# EAGLE board rep_ctrlr (EAGLE 6.2), part 1 of 2
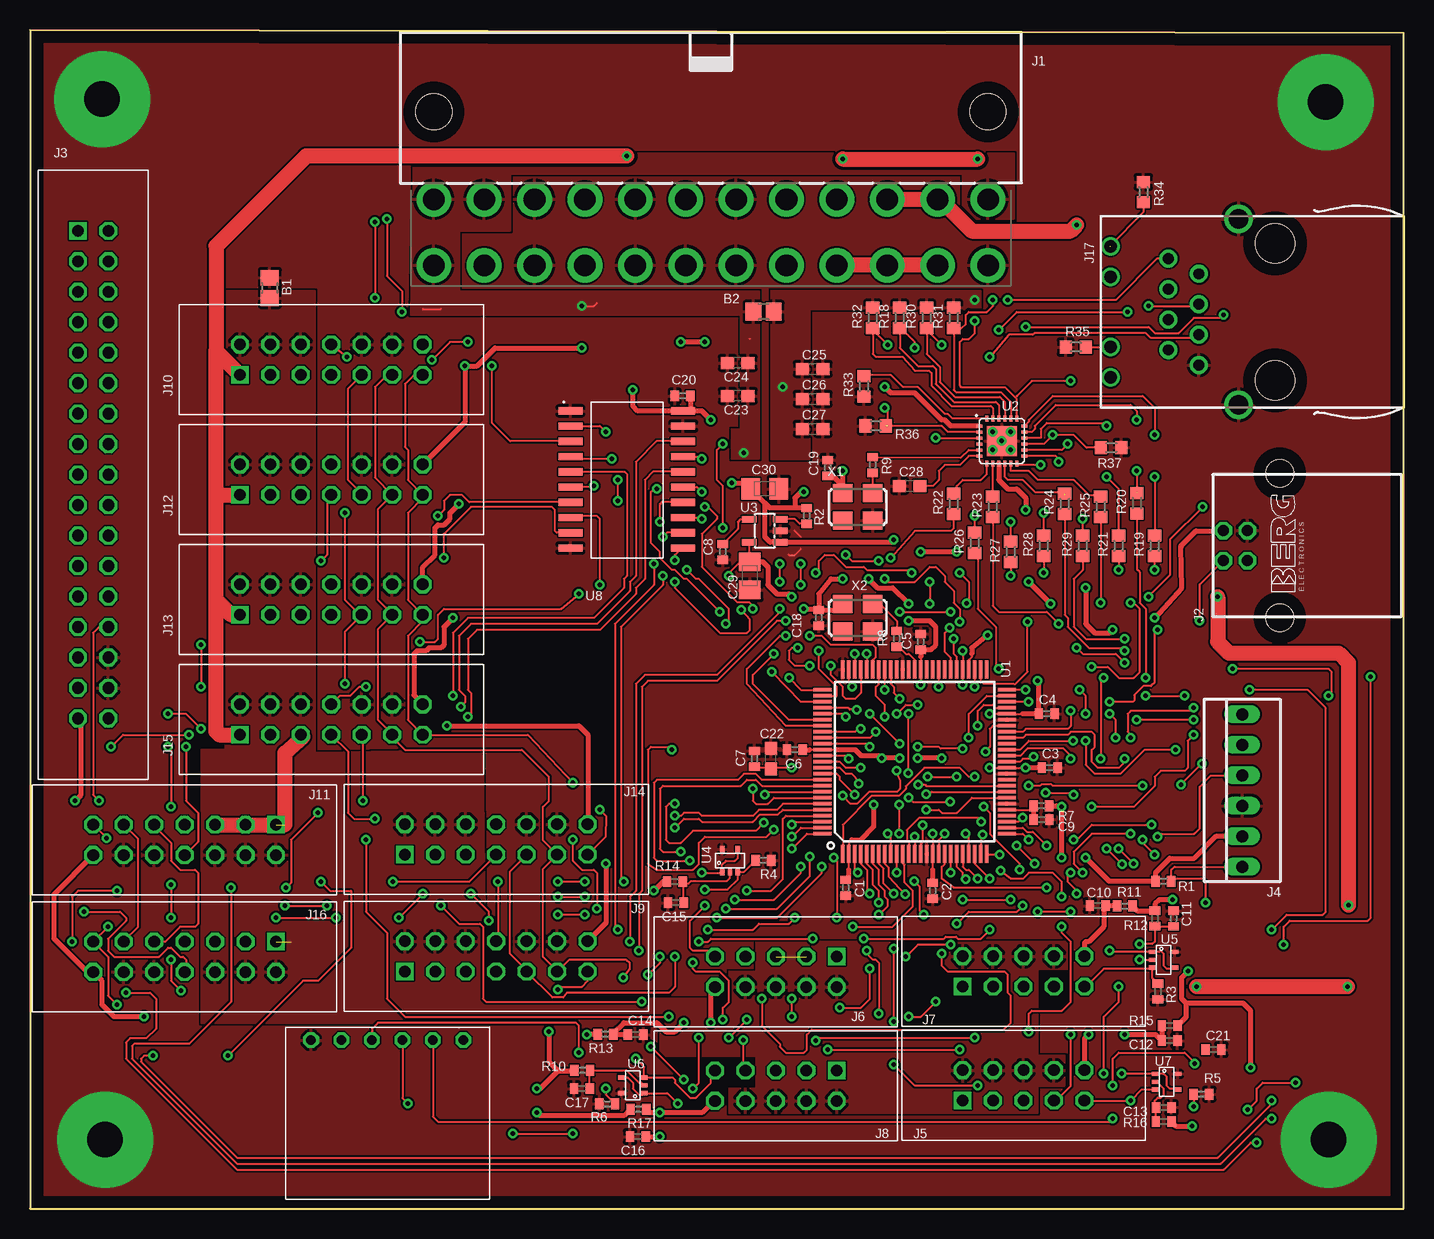
[diagram p5: board, top side]
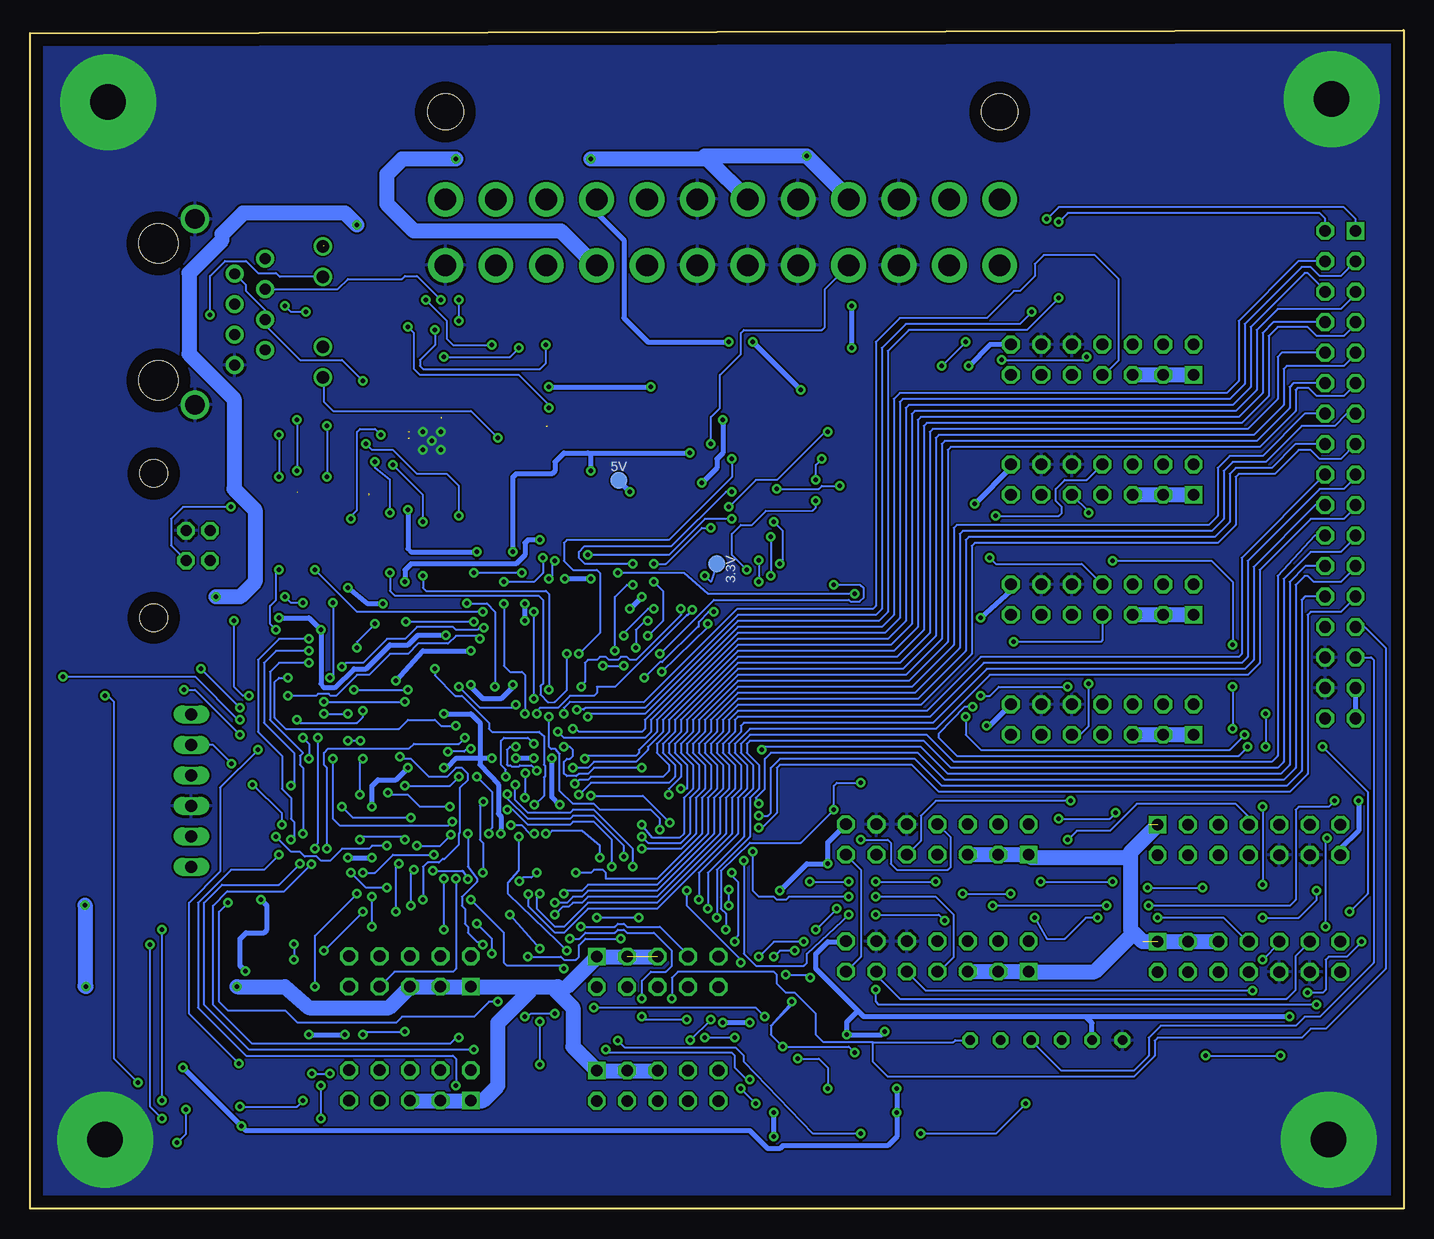
[diagram p6: board, bottom side, seen from below]

Size 114.5 x 98.25 mm. Coordinates in mm from the lower left corner, seen from the top.
Outline: 0,0 114.5,0 114.5,98 0,98.25 0,0
Copper layers (1*16): Top 0.035mm / dielectric 1.5mm / Bottom 0.035mm
Design rules: minimum track width 6mil, minimum drill 15mil, track to track 6mil, track to pad 6mil, pad to pad 6mil, via to via 6mil, smd to smd 6mil, copper to edge 40mil, drill to drill 4mil, minimum pad ring 10mil, minimum via ring 8mil, stop-mask expansion 4mil, vias tented up to drill 0mil, thermal gap 10mil

## Footprints (pad centres in the part's own frame; a part is rotated, then mirrored left to right if it is on the bottom)
TP14R = smd 1.4 x 1.4: TP 0,0
R0805 = smd 1.3 x 1.5: 1 -0.85,0; 2 0.85,0
C0402 = smd 0.7 x 0.9: 1 -0.65,0; 2 0.65,0
C0603 = smd 1.1 x 1: 1 -0.85,0; 2 0.85,0
R/2012-12R = smd 1.55 x 1.8: + 1.175,0; - -1.175,0
ATX24_RIGHT_ANGLE = drill 1.8 pad 2.9: 1 23.1,4.76; 2 18.9,4.76; 3 14.7,4.76; 4 10.5,4.76; 5 6.3,4.76; 6 2.1,4.76; 7 -2.1,4.76; 8 -6.3,4.76; 9 -10.5,4.76; 10 -14.7,4.76; 11 -18.9,4.76; 12 -23.1,4.76; 13 23.1,10.26; 14 18.9,10.26; 15 14.7,10.26; 16 10.5,10.26; 17 6.3,10.26; 18 2.1,10.26; 19 -2.1,10.26; 20 -6.3,10.26; 21 -10.5,10.26; 22 -14.7,10.26; 23 -18.9,10.26; 24 -23.1,10.26 | hole 3: -23.1,-2.54; 23.1,-2.54
PN61729 = drill 0.95 octagon: 1 1.25,4.71; 2 -1.25,4.71; 3 -1.25,2.71; 4 1.25,2.71 | hole 2.3: -6.02,0; 6.02,0
SBH11-PBPC-D17-ST-BK = drill 0.991 square: 1 0,0 | drill 0.991 octagon: 2 2.54,0; 3 0,-2.54; 4 2.54,-2.54; 5 0,-5.08; 6 2.54,-5.08; 7 0,-7.62; 8 2.54,-7.62; 9 0,-10.16; 10 2.54,-10.16; 11 0,-12.7; 12 2.54,-12.7; 13 0,-15.24; 14 2.54,-15.24; 15 0,-17.78; 16 2.54,-17.78; 17 0,-20.32; 18 2.54,-20.32; 19 0,-22.86; 20 2.54,-22.86; 21 0,-25.4; 22 2.54,-25.4; 23 0,-27.94; 24 2.54,-27.94; 25 0,-30.48; 26 2.54,-30.48; 27 0,-33.02; 28 2.54,-33.02; 29 0,-35.56; 30 2.54,-35.56; 31 0,-38.1; 32 2.54,-38.1; 33 0,-40.64; 34 2.54,-40.64
22-23-2061 = drill 1 long: 1 -6.35,0; 2 -3.81,0; 3 -1.27,0; 4 1.27,0; 5 3.81,0; 6 6.35,0
SBH11-PBPC-D05-ST-BK = drill 0.991 square: 1 0,0 | drill 0.991 octagon: 2 2.54,0; 3 0,-2.54; 4 2.54,-2.54; 5 0,-5.08; 6 2.54,-5.08; 7 0,-7.62; 8 2.54,-7.62; 9 0,-10.16; 10 2.54,-10.16
SBH11-PBPC-D07-ST-BK = drill 0.991 square: 1 0,0 | drill 0.991 octagon: 2 2.54,0; 3 0,-2.54; 4 2.54,-2.54; 5 0,-5.08; 6 2.54,-5.08; 7 0,-7.62; 8 2.54,-7.62; 9 0,-10.16; 10 2.54,-10.16; 11 0,-12.7; 12 2.54,-12.7; 13 0,-15.24; 14 2.54,-15.24
SI-50170 = drill 0.9 pad 1.5: 1 4.445,5.842; 2 3.175,3.302; 3 1.905,5.842; 4 0.635,3.302; 5 -0.635,5.842; 6 -1.905,3.302; 7 -3.175,5.842; 8 -4.445,3.302 | drill 1.016 pad 1.5: A1 -5.461,10.668; A2 2.921,10.668; C1 -2.921,10.668; C2 5.461,10.668 | drill 1.6 pad 2.2: S1 -7.747,0; S2 7.747,0 | hole 3.251: -5.715,-3.048; 5.715,-3.048
70553-0109 = drill 0.8 pad 1.09 octagon: P$1 5.08,-7.62; P$2 5.08,-5.08; P$3 5.08,-2.54; P$4 5.08,0; P$5 5.08,2.54; P$6 5.08,5.08
R0402 = smd 0.7 x 0.9: 1 -0.65,0; 2 0.65,0
R0603 = smd 1 x 1.1: 1 -0.85,0; 2 0.85,0
MICROCHIP_TQ100-PF = smd 1.5 x 0.3: 1 -7.7,6; 2 -7.7,5.5; 3 -7.7,5; 4 -7.7,4.5; 5 -7.7,4; 6 -7.7,3.5; 7 -7.7,3; 8 -7.7,2.5; 9 -7.7,2; 10 -7.7,1.5; 11 -7.7,1; 12 -7.7,0.5; 13 -7.7,0; 14 -7.7,-0.5; 15 -7.7,-1; 16 -7.7,-1.5; 17 -7.7,-2; 18 -7.7,-2.5; 19 -7.7,-3; 20 -7.7,-3.5; 21 -7.7,-4; 22 -7.7,-4.5; 23 -7.7,-5; 24 -7.7,-5.5; 25 -7.7,-6; 51 7.7,-6; 52 7.7,-5.5; 53 7.7,-5; 54 7.7,-4.5; 55 7.7,-4; 56 7.7,-3.5; 57 7.7,-3; 58 7.7,-2.5; 59 7.7,-2; 60 7.7,-1.5; 61 7.7,-1; 62 7.7,-0.5; 63 7.7,0; 64 7.7,0.5; 65 7.7,1; 66 7.7,1.5; 67 7.7,2; 68 7.7,2.5; 69 7.7,3; 70 7.7,3.5; 71 7.7,4; 72 7.7,4.5; 73 7.7,5; 74 7.7,5.5; 75 7.7,6 | smd 0.3 x 1.5: 26 -6,-7.7; 27 -5.5,-7.7; 28 -5,-7.7; 29 -4.5,-7.7; 30 -4,-7.7; 31 -3.5,-7.7; 32 -3,-7.7; 33 -2.5,-7.7; 34 -2,-7.7; 35 -1.5,-7.7; 36 -1,-7.7; 37 -0.5,-7.7; 38 0,-7.7; 39 0.5,-7.7; 40 1,-7.7; 41 1.5,-7.7; 42 2,-7.7; 43 2.5,-7.7; 44 3,-7.7; 45 3.5,-7.7; 46 4,-7.7; 47 4.5,-7.7; 48 5,-7.7; 49 5.5,-7.7; 50 6,-7.7; 76 6,7.7; 77 5.5,7.7; 78 5,7.7; 79 4.5,7.7; 80 4,7.7; 81 3.5,7.7; 82 3,7.7; 83 2.5,7.7; 84 2,7.7; 85 1.5,7.7; 86 1,7.7; 87 0.5,7.7; 88 0,7.7; 89 -0.5,7.7; 90 -1,7.7; 91 -1.5,7.7; 92 -2,7.7; 93 -2.5,7.7; 94 -3,7.7; 95 -3.5,7.7; 96 -4,7.7; 97 -4.5,7.7; 98 -5,7.7; 99 -5.5,7.7; 100 -6,7.7
QFN24 = smd 0.5 x 0.25: P1 -1.875,1.25; P2 -1.875,0.75; P3 -1.875,0.25; P4 -1.875,-0.25; P5 -1.875,-0.75; P6 -1.875,-1.25; P13 1.875,-1.25; P14 1.875,-0.75; P15 1.875,-0.25; P16 1.875,0.25; P17 1.875,0.75; P18 1.875,1.25 | smd 0.25 x 0.5: P7 -1.25,-1.875; P8 -0.75,-1.875; P9 -0.25,-1.875; P10 0.25,-1.875; P11 0.75,-1.875; P12 1.25,-1.875; P19 1.25,1.875; P20 0.75,1.875; P21 0.25,1.875; P22 -0.25,1.875; P23 -0.75,1.875; P24 -1.25,1.875 | smd 2.5 x 2.5: PAD 0,0
SOT23-5 = smd 0.55 x 1.2: 1 -0.95,-1.3; 2 0,-1.3; 3 0.95,-1.3; 4 0.95,1.3; 5 -0.95,1.3
MICROCHIP_SC70-5-LT = smd 0.35 x 0.55: 1 -0.65,-0.95; 2 0,-0.95; 3 0.65,-0.95; 4 0.65,0.95; 5 -0.65,0.95
20-SOIC = smd 2 x 0.6: 1 -4.7,5.75; 2 -4.7,4.48; 3 -4.7,3.21; 4 -4.7,1.94; 5 -4.7,0.67; 6 -4.7,-0.6; 7 -4.7,-1.87; 8 -4.7,-3.14; 9 -4.7,-4.41; 10 -4.7,-5.68; 11 4.7,-5.68; 12 4.7,-4.41; 13 4.7,-3.14; 14 4.7,-1.87; 15 4.7,-0.6; 16 4.7,0.67; 17 4.7,1.94; 18 4.7,3.21; 19 4.7,4.48; 20 4.7,5.75
ASF = smd 1.6 x 1.5: 1 -1.25,-1.15; 2 1.25,-1.15; 3 1.25,1.15; 4 -1.25,1.15

## Placement (x,y rotation side)
3.3V  PTR1TP14R  [TP14R]  57.25,53.75 270 bottom
5V  PTR1TP14R  [TP14R]  65.4,60.7 0 bottom
B1  FERRITE  [R0805]  19.98,76.75 270 top
B2  FERRITE  [R0805]  61.16,74.77 180 top
C1  0.1u  [C0402]  68,26.75 270 top
C2  0.1u  [C0402]  75.25,26.5 270 top
C3  0.1u  [C0402]  85,36.75 0 top
C4  0.1u  [C0402]  84.75,41.25 0 top
C5  0.1u  [C0402]  74.25,47.25 90 top
C6  0.1u  [C0402]  63.75,38.25 180 top
C7  0.1u  [C0402]  60.4,37.5 90 top
C8  .1uF  [C0402]  57.75,54.75 270 top
C9  0.1u  [C0402]  84.33,32.42 0 top
C10  0.1u  [C0402]  89,25.25 180 top
C11  0.1u  [C0402]  95.33,24.17 90 top
C12  0.1u  [C0402]  95,14 0 top
C13  0.1u  [C0402]  94.51,8.42 0 top
C14  0.1u  [C0402]  50.49,14.5 0 top
C15  0.1u  [C0402]  53.84,25.5 180 top
C16  0.1u  [C0402]  50.67,6 180 top
C17  0.1u  [C0402]  46,10 180 top
C18  0.1u  [C0402]  65.75,49.25 270 top
C19  0.1uF  [C0402]  66.5,61.75 90 top
C20  0.1u  [C0402]  54.4,67.75 180 top
C21  0.1uF  [C0402]  98.66,13.25 0 top
C22  10u  [C0603]  61.75,37.5 90 top
C23  0.1uF  [C0603]  59,67.75 180 top
C24  0.1uF  [C0603]  59,70.5 180 top
C25  0.1uF  [C0603]  65.25,70 0 top
C26  0.1uF  [C0603]  65.25,67.5 0 top
C27  1uF  [C0603]  65.25,65 0 top
C28  1uF  [C0603]  73.34,60.25 0 top
C29  4.7uF  [R/2012-12R]  60,52.75 90 top
C30  4.7uF  [R/2012-12R]  61.25,60 180 top
J1  0874272402  [ATX24_RIGHT_ANGLE]  56.76,88.89 180 top
J2  [PN61729]  104.19,55.27 90 top
J3  SBH11-PBPC-D17-ST-BK  [SBH11-PBPC-D17-ST-BK]  4,81.5 0 top
J4  [22-23-2061]  101.05,34.85 90 top
J5  SBH11-PBPC-D05-ST-BK  [SBH11-PBPC-D05-ST-BK]  77.75,9 90 top
J6  SBH11-PBPC-D05-ST-BK  [SBH11-PBPC-D05-ST-BK]  67.25,21 270 top
J7  SBH11-PBPC-D05-ST-BK  [SBH11-PBPC-D05-ST-BK]  77.75,18.5 90 top
J8  SBH11-PBPC-D05-ST-BK  [SBH11-PBPC-D05-ST-BK]  67.25,11.5 270 top
J9  SBH11-PBPC-D07-ST-BK  [SBH11-PBPC-D07-ST-BK]  31.25,19.75 90 top
J10  SBH11-PBPC-D07-ST-BK  [SBH11-PBPC-D07-ST-BK]  17.5,69.5 90 top
J11  SBH11-PBPC-D07-ST-BK  [SBH11-PBPC-D07-ST-BK]  20.5,32 270 top
J12  SBH11-PBPC-D07-ST-BK  [SBH11-PBPC-D07-ST-BK]  17.5,59.5 90 top
J13  SBH11-PBPC-D07-ST-BK  [SBH11-PBPC-D07-ST-BK]  17.5,49.5 90 top
J14  SBH11-PBPC-D07-ST-BK  [SBH11-PBPC-D07-ST-BK]  31.25,29.5 90 top
J15  SBH11-PBPC-D07-ST-BK  [SBH11-PBPC-D07-ST-BK]  17.5,39.5 90 top
J16  SBH11-PBPC-D07-ST-BK  [SBH11-PBPC-D07-ST-BK]  20.5,22.25 270 top
J17  SI-50170-F  [SI-50170]  100.75,74.75 90 top
J18  70553-0106  [70553-0109]  28.51,8.95 90 top
R1  4.7k  [R0402]  94.49,27.28 180 top
R2  10k  [R0402]  64.75,57.75 270 top
R3  10K  [R0402]  94.03,18.09 90 top
R4  10K  [R0402]  61.14,29.03 180 top
R5  10K  [R0402]  97.65,9.53 180 top
R6  10K  [R0402]  48.12,8.72 0 top
R7  10  [R0402]  84.32,33.57 0 top
R8  10  [R0402]  72.25,47.5 90 top
R9  10  [R0402]  70.25,62 270 top
R10  10  [R0402]  46.04,11.53 180 top
R11  10  [R0402]  91.26,25.22 0 top
R12  10  [R0402]  93.78,24.18 90 top
R13  10  [R0402]  47.97,14.53 180 top
R14  10  [R0402]  53.75,27.25 180 top
R15  10  [R0402]  95,15.25 0 top
R16  10  [R0402]  94.5,7.25 0 top
R17  10  [R0402]  50.71,8.28 180 top
R18  49.9  [R0603]  72.5,74.25 90 top
R19  49.9  [R0603]  93.75,55.25 90 top
R20  49.9  [R0603]  92.28,58.8 90 top
R21  49.9  [R0603]  90.75,55.25 90 top
R22  49.9  [R0603]  77,58.75 90 top
R23  49.9  [R0603]  80.25,58.5 90 top
R24  49.9  [R0603]  86.25,58.75 90 top
R25  49.9  [R0603]  89.25,58.5 90 top
R26  49.9  [R0603]  78.75,55.5 90 top
R27  49.9  [R0603]  81.75,54.75 90 top
R28  49.9  [R0603]  84.5,55.25 90 top
R29  49.9  [R0603]  87.75,55.25 90 top
R30  49.9  [R0603]  74.75,74.25 90 top
R31  49.9  [R0603]  77,74.25 90 top
R32  49.9  [R0603]  70.25,74.25 90 top
R33  12.1k 1%  [R0603]  69.52,68.54 90 top
R34  270  [R0603]  92.82,84.73 270 top
R35  270  [R0603]  87.19,71.82 0 top
R36  10k  [R0603]  70.5,65.25 0 top
R37  10k  [R0603]  90.14,63.43 180 top
U1  MICROCHIP_PIC32MX7X5F256L-PF  [MICROCHIP_TQ100-PF]  73.75,37.25 90 top
U2  8720A_PHY  [QFN24]  81,64 0 top
U3  LDS3985XX33  [SOT23-5]  61.25,56.5 90 top
U4  MICROCHIP_MCP6001-LT  [MICROCHIP_SC70-5-LT]  58.35,29 0 top
U5  MICROCHIP_MCP6001-LT  [MICROCHIP_SC70-5-LT]  94.5,20.74 270 top
U6  MICROCHIP_MCP6001-LT  [MICROCHIP_SC70-5-LT]  50.25,10.27 90 top
U7  MICROCHIP_MCP6001-LT  [MICROCHIP_SC70-5-LT]  94.75,10.57 270 top
U8  SN74ACT244  [20-SOIC]  49.75,60.75 0 top
X1  ASFL1  [ASF]  69,58.5 0 top
X2  ASFL1  [ASF]  69,49.25 0 top